# EAGLE schematic Schematic_1 (EAGLE 9.4.2)
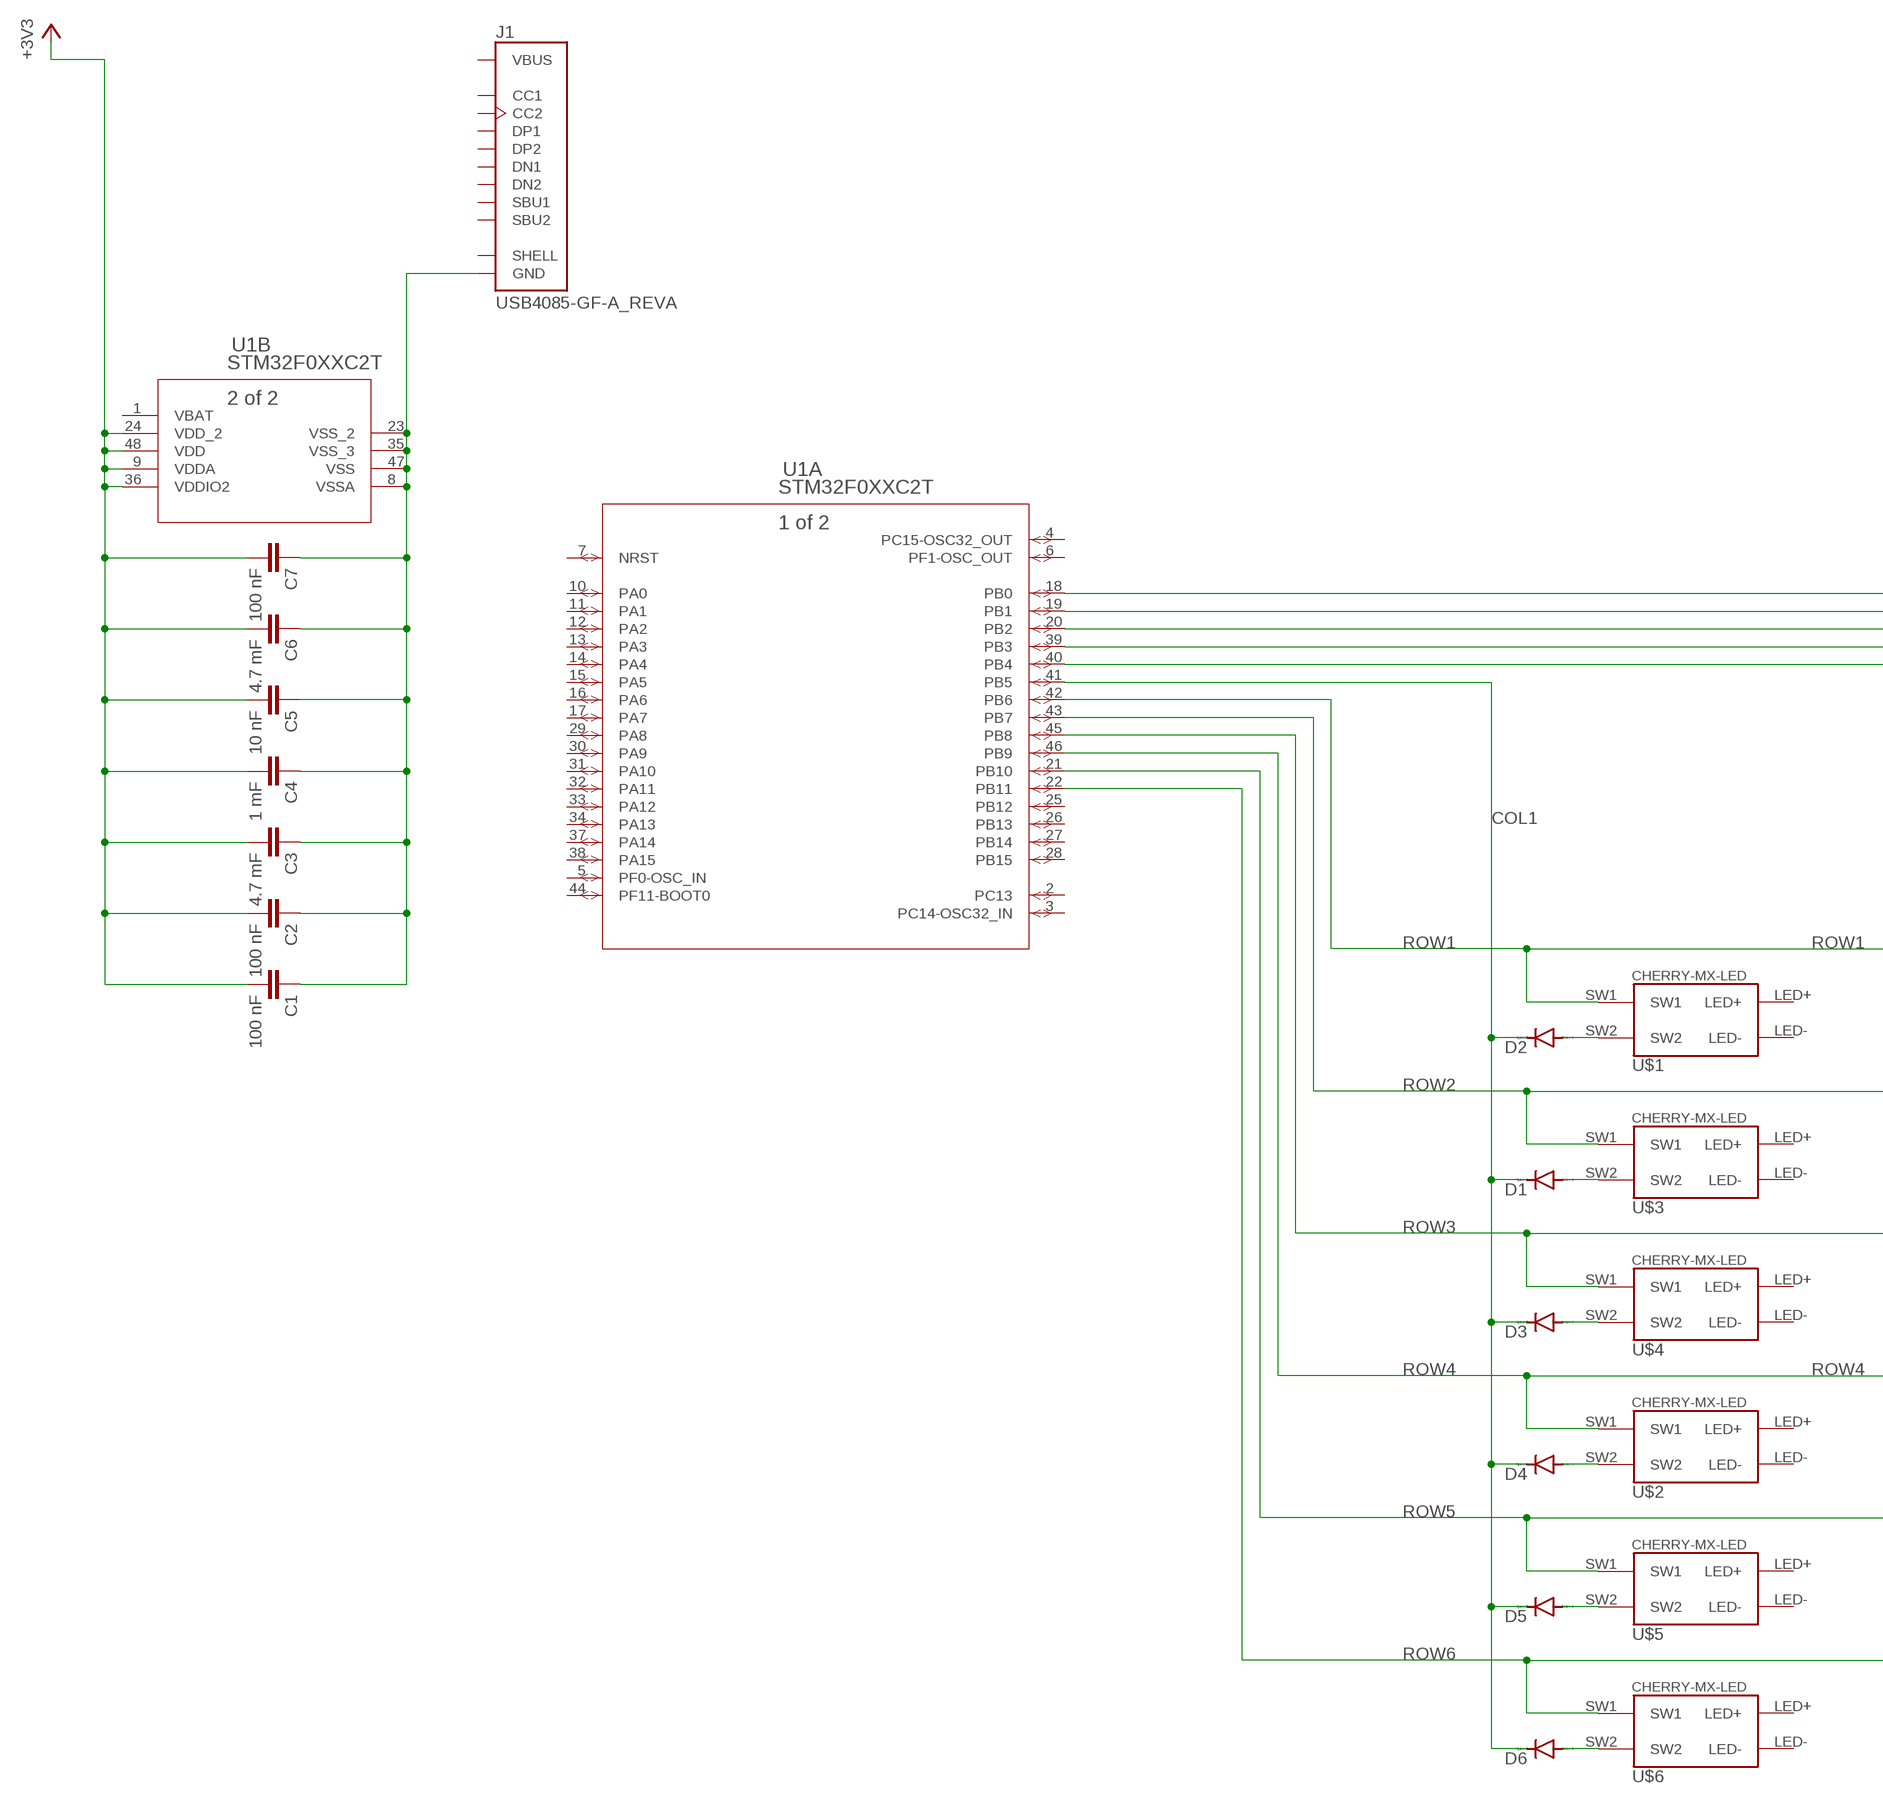
[diagram p0: schematic, sheet 1, part 1 of 2]
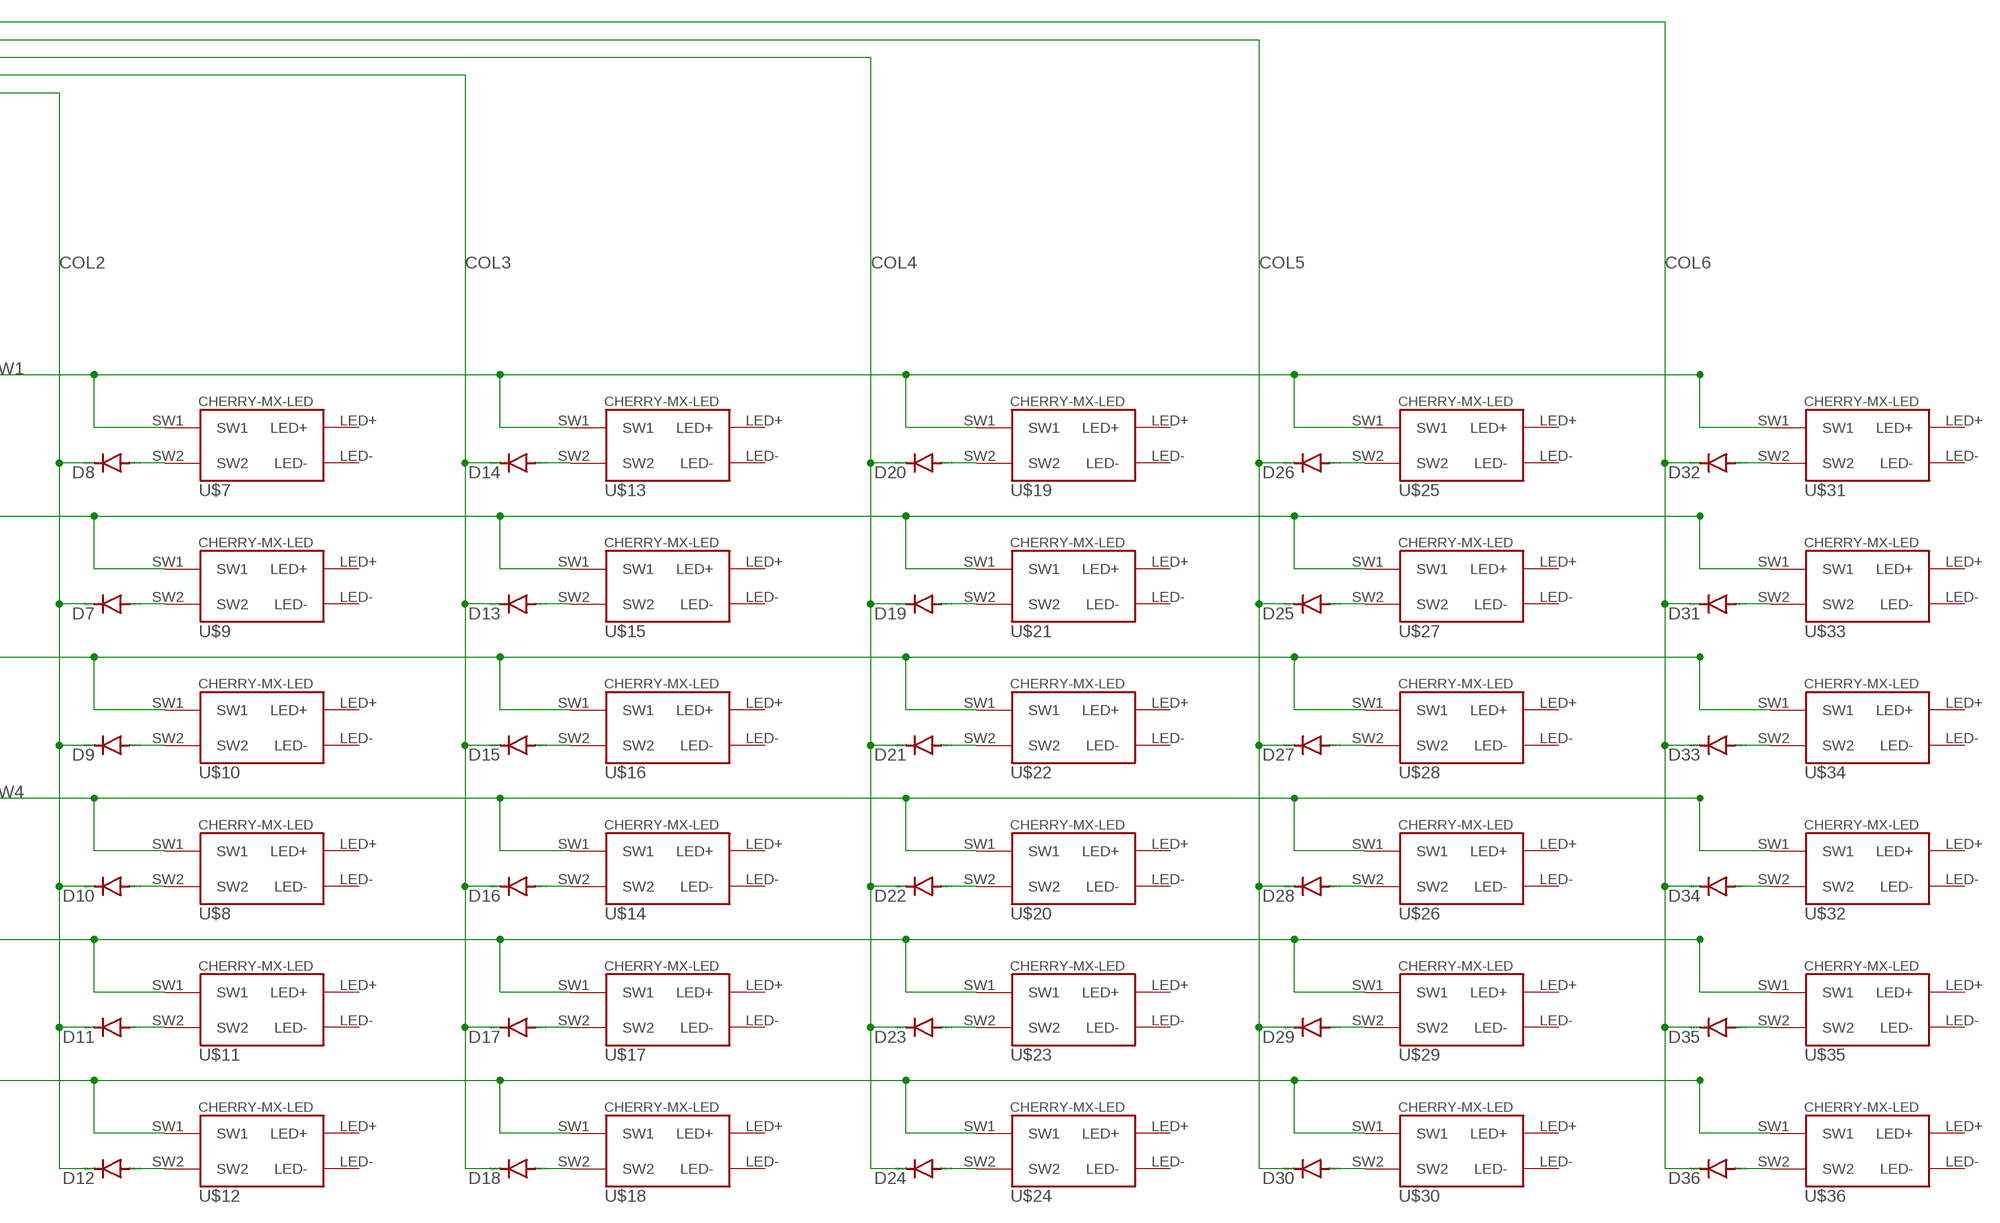
[diagram p1: schematic, sheet 1, part 2 of 2]

## Parts
C1  100 nF  C2,5-3  [C2.5-3]
C2  100 nF  C2,5-3  [C2.5-3]
C3  4.7 mF  C2,5-3  [C2.5-3]
C4  1 mF  C2,5-3  [C2.5-3]
C5  10 nF  C2,5-3  [C2.5-3]
C6  4.7 mF  C2,5-3  [C2.5-3]
C7  100 nF  C2,5-3  [C2.5-3]
D1  DIODE-SOD80C  [SOD80C]
D2  DIODE-SOD80C  [SOD80C]
D3  DIODE-SOD80C  [SOD80C]
D4  DIODE-SOD80C  [SOD80C]
D5  DIODE-SOD80C  [SOD80C]
D6  DIODE-SOD80C  [SOD80C]
D7  DIODE-SOD80C  [SOD80C]
D8  DIODE-SOD80C  [SOD80C]
D9  DIODE-SOD80C  [SOD80C]
D10  DIODE-SOD80C  [SOD80C]
D11  DIODE-SOD80C  [SOD80C]
D12  DIODE-SOD80C  [SOD80C]
D13  DIODE-SOD80C  [SOD80C]
D14  DIODE-SOD80C  [SOD80C]
D15  DIODE-SOD80C  [SOD80C]
D16  DIODE-SOD80C  [SOD80C]
D17  DIODE-SOD80C  [SOD80C]
D18  DIODE-SOD80C  [SOD80C]
D19  DIODE-SOD80C  [SOD80C]
D20  DIODE-SOD80C  [SOD80C]
D21  DIODE-SOD80C  [SOD80C]
D22  DIODE-SOD80C  [SOD80C]
D23  DIODE-SOD80C  [SOD80C]
D24  DIODE-SOD80C  [SOD80C]
D25  DIODE-SOD80C  [SOD80C]
D26  DIODE-SOD80C  [SOD80C]
D27  DIODE-SOD80C  [SOD80C]
D28  DIODE-SOD80C  [SOD80C]
D29  DIODE-SOD80C  [SOD80C]
D30  DIODE-SOD80C  [SOD80C]
D31  DIODE-SOD80C  [SOD80C]
D32  DIODE-SOD80C  [SOD80C]
D33  DIODE-SOD80C  [SOD80C]
D34  DIODE-SOD80C  [SOD80C]
D35  DIODE-SOD80C  [SOD80C]
D36  DIODE-SOD80C  [SOD80C]
J1  USB4085-GF-A_REVA  [GCT_USB4085-GF-A_REVA]
U1  STM32F0XXC2T  [LQFP48-7X7MM]
U$1  CHERRY-MX-LED  [CHERRY-MX-LED]
U$2  CHERRY-MX-LED  [CHERRY-MX-LED]
U$3  CHERRY-MX-LED  [CHERRY-MX-LED]
U$4  CHERRY-MX-LED  [CHERRY-MX-LED]
U$5  CHERRY-MX-LED  [CHERRY-MX-LED]
U$6  CHERRY-MX-LED  [CHERRY-MX-LED]
U$7  CHERRY-MX-LED  [CHERRY-MX-LED]
U$8  CHERRY-MX-LED  [CHERRY-MX-LED]
U$9  CHERRY-MX-LED  [CHERRY-MX-LED]
U$10  CHERRY-MX-LED  [CHERRY-MX-LED]
U$11  CHERRY-MX-LED  [CHERRY-MX-LED]
U$12  CHERRY-MX-LED  [CHERRY-MX-LED]
U$13  CHERRY-MX-LED  [CHERRY-MX-LED]
U$14  CHERRY-MX-LED  [CHERRY-MX-LED]
U$15  CHERRY-MX-LED  [CHERRY-MX-LED]
U$16  CHERRY-MX-LED  [CHERRY-MX-LED]
U$17  CHERRY-MX-LED  [CHERRY-MX-LED]
U$18  CHERRY-MX-LED  [CHERRY-MX-LED]
U$19  CHERRY-MX-LED  [CHERRY-MX-LED]
U$20  CHERRY-MX-LED  [CHERRY-MX-LED]
U$21  CHERRY-MX-LED  [CHERRY-MX-LED]
U$22  CHERRY-MX-LED  [CHERRY-MX-LED]
U$23  CHERRY-MX-LED  [CHERRY-MX-LED]
U$24  CHERRY-MX-LED  [CHERRY-MX-LED]
U$25  CHERRY-MX-LED  [CHERRY-MX-LED]
U$26  CHERRY-MX-LED  [CHERRY-MX-LED]
U$27  CHERRY-MX-LED  [CHERRY-MX-LED]
U$28  CHERRY-MX-LED  [CHERRY-MX-LED]
U$29  CHERRY-MX-LED  [CHERRY-MX-LED]
U$30  CHERRY-MX-LED  [CHERRY-MX-LED]
U$31  CHERRY-MX-LED  [CHERRY-MX-LED]
U$32  CHERRY-MX-LED  [CHERRY-MX-LED]
U$33  CHERRY-MX-LED  [CHERRY-MX-LED]
U$34  CHERRY-MX-LED  [CHERRY-MX-LED]
U$35  CHERRY-MX-LED  [CHERRY-MX-LED]
U$36  CHERRY-MX-LED  [CHERRY-MX-LED]

## Nets
COL1: D1.C D2.C D3.C D4.C D5.C D6.C U1.41(A:PB5)
COL2: D7.C D8.C D9.C D10.C D11.C D12.C U1.40(A:PB4)
COL3: D13.C D14.C D15.C D16.C D17.C D18.C U1.39(A:PB3)
COL4: D19.C D20.C D21.C D22.C D23.C D24.C U1.20(A:PB2)
COL5: D25.C D26.C D27.C D28.C D29.C D30.C U1.19(A:PB1)
COL6: D31.C D32.C D33.C D34.C D35.C D36.C U1.18(A:PB0)
N$1: D2.A U$1.SW2
N$2: D1.A U$3.SW2
N$3: D3.A U$4.SW2
N$4: D6.A U$6.SW2
N$5: D8.A U$7.SW2
N$6: D4.A U$2.SW2
N$7: D5.A U$5.SW2
N$8: D7.A U$9.SW2
N$9: D9.A U$10.SW2
N$10: D10.A U$8.SW2
N$11: D11.A U$11.SW2
N$12: D12.A U$12.SW2
N$13: D14.A U$13.SW2
N$14: D13.A U$15.SW2
N$15: D15.A U$16.SW2
N$16: D16.A U$14.SW2
N$17: D17.A U$17.SW2
N$18: D18.A U$18.SW2
N$19: D20.A U$19.SW2
N$20: D19.A U$21.SW2
N$21: D21.A U$22.SW2
N$22: D22.A U$20.SW2
N$23: D23.A U$23.SW2
N$24: D24.A U$24.SW2
N$25: D26.A U$25.SW2
N$26: D25.A U$27.SW2
N$27: D27.A U$28.SW2
N$28: D28.A U$26.SW2
N$29: D29.A U$29.SW2
N$30: D30.A U$30.SW2
N$31: D32.A U$31.SW2
N$32: D31.A U$33.SW2
N$33: D33.A U$34.SW2
N$34: D34.A U$32.SW2
N$35: D35.A U$35.SW2
N$36: D36.A U$36.SW2
N$37: C1.1 C2.1 C3.1 C4.1 C5.1 C6.1 C7.1 J1.A1(GND) J1.A12(GND) J1.B1(GND) J1.B12(GND) U1.8(B:VSSA) U1.23(B:VSS_2) U1.35(B:VSS_3) U1.47(B:VSS)
REDUNDENT: C1.2 C2.2 C3.2 C4.2 C5.2 C6.2 C7.2 U1.9(B:VDDA) U1.24(B:VDD_2) U1.36(B:VDDIO2) U1.48(B:VDD) ; supply symbol labelled +3V3
ROW1: U1.42(A:PB6) U$1.SW1 U$7.SW1 U$13.SW1
ROW2: U1.43(A:PB7) U$3.SW1 U$9.SW1 U$15.SW1
ROW3: U1.45(A:PB8) U$4.SW1 U$10.SW1 U$16.SW1
ROW4: U1.46(A:PB9) U$2.SW1 U$8.SW1 U$14.SW1
ROW5: U1.21(A:PB10) U$5.SW1 U$11.SW1 U$17.SW1
ROW6: U1.22(A:PB11) U$6.SW1 U$12.SW1 U$18.SW1
ROW13: U$19.SW1
ROW14: U$21.SW1
ROW15: U$22.SW1
ROW16: U$20.SW1
ROW17: U$23.SW1
ROW18: U$24.SW1
ROW19: U$25.SW1
ROW20: U$27.SW1
ROW21: U$28.SW1
ROW22: U$26.SW1
ROW23: U$29.SW1
ROW24: U$30.SW1
ROW25: U$31.SW1
ROW26: U$33.SW1
ROW27: U$34.SW1
ROW28: U$32.SW1
ROW29: U$35.SW1
ROW30: U$36.SW1
Unconnected: J1.A5(CC1) J1.A6(DP1) J1.A7(DN1) J1.A8(SBU1) J1.B5(CC2) J1.B6(DP2) J1.B7(DN2) J1.B8(SBU2) J1.P1(SHELL) J1.P2(SHELL) J1.P3(SHELL) J1.P4(SHELL) U1.2(A:PC13) U1.3(A:PC14-OSC32_IN) U1.4(A:PC15-OSC32_OUT) U1.5(A:PF0-OSC_IN) U1.6(A:PF1-OSC_OUT) U1.7(A:NRST) U1.10(A:PA0) U1.11(A:PA1) U1.12(A:PA2) U1.13(A:PA3) U1.14(A:PA4) U1.15(A:PA5) U1.16(A:PA6) U1.17(A:PA7) U1.25(A:PB12) U1.26(A:PB13) U1.27(A:PB14) U1.28(A:PB15) U1.29(A:PA8) U1.30(A:PA9) U1.31(A:PA10) U1.32(A:PA11) U1.33(A:PA12) U1.34(A:PA13) U1.37(A:PA14) U1.38(A:PA15) U1.44(A:PF11-BOOT0) U$1.LED+ U$1.LED- U$2.LED+ U$2.LED- U$3.LED+ U$3.LED- U$4.LED+ U$4.LED- U$5.LED+ U$5.LED- U$6.LED+ U$6.LED- U$7.LED+ U$7.LED- U$8.LED+ U$8.LED- U$9.LED+ U$9.LED- U$10.LED+ U$10.LED- U$11.LED+ U$11.LED- U$12.LED+ U$12.LED- U$13.LED+ U$13.LED- U$14.LED+ U$14.LED- U$15.LED+ U$15.LED- U$16.LED+ U$16.LED- U$17.LED+ U$17.LED- U$18.LED+ U$18.LED- U$19.LED+ U$19.LED- U$20.LED+ U$20.LED- U$21.LED+ U$21.LED- U$22.LED+ U$22.LED- U$23.LED+ U$23.LED- U$24.LED+ U$24.LED- U$25.LED+ U$25.LED- U$26.LED+ U$26.LED- U$27.LED+ U$27.LED- U$28.LED+ U$28.LED- U$29.LED+ U$29.LED- U$30.LED+ U$30.LED- U$31.LED+ U$31.LED- U$32.LED+ U$32.LED- U$33.LED+ U$33.LED- U$34.LED+ U$34.LED- U$35.LED+ U$35.LED- U$36.LED+ U$36.LED-

## Power pins joined to a net without a drawn wire
VBAT: U1.1(B:VBAT)
VBUS: J1.A4(VBUS) J1.A9(VBUS) J1.B4(VBUS) J1.B9(VBUS)

## Library data of the parts
C1-C7 = capacitor-wima:C: CAPACITOR naming: grid - package width
D1-D36 = diode:DIODE-: DIODE
J1 = USB4085-GF-A_REVA:USB4085-GF-A_REVA: USB 2.0 Type C Receptacle Dip Type, PCB Top Mount; AVAILABILITY: Unavailable; MF: Global Connector Technology; MP: USB4085-GF-A; PACKAGE: Package Analog Devices; PRICE: None
U1 = STM32F0XXC2T:STM32F0XXC2T; MANUFACTURER_PART_NUMBER: STM32F0XXC2T; VENDOR: STMicroelectronics
U$1-U$36 = cherrymx:CHERRY-MX-LED: Cherry MX series keyswitch with LED